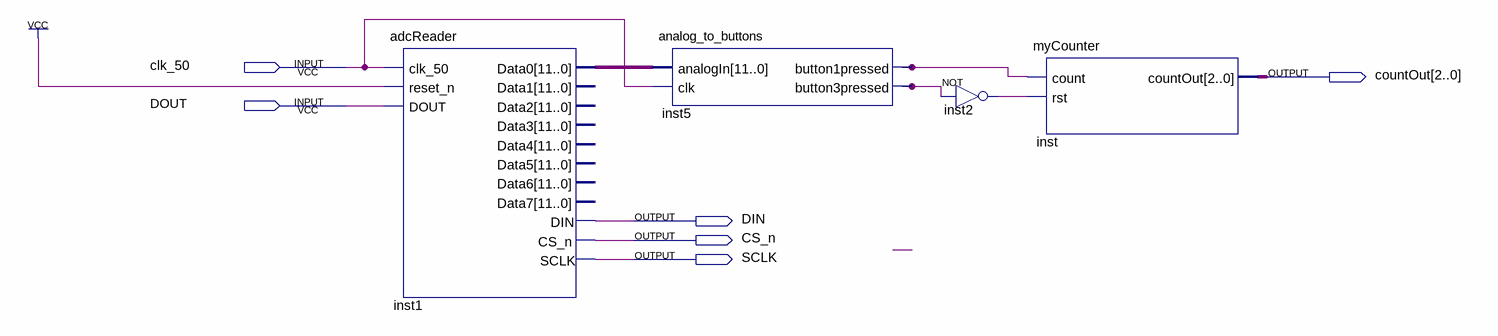
[diagram p0: schematic sheet]
// Quartus schematic CounterWithOutput.bdf as structural Verilog: 4 symbols, 6 pins
module CounterWithOutput (
  input  clk_50,
  input  DOUT,
  output [2:0] countOut,
  output DIN,
  output CS_n,
  output SCLK
);

  wire inst2_out, inst5_button1pressed, inst5_button3pressed;
  wire [11:0] inst1_data0;

  adcReader inst1 (
    .clk_50(clk_50), .reset_n(1'b1), .DOUT(DOUT), .Data0(inst1_data0), .DIN(DIN), .CS_n(CS_n), .SCLK(SCLK));  // open: Data1, Data2, Data3, Data4, Data5, Data6, Data7
  analog_to_buttons inst5 (
    .analogIn(inst1_data0), .clk(clk_50), .button1pressed(inst5_button1pressed),
    .button3pressed(inst5_button3pressed));
  not inst2 (inst2_out, inst5_button3pressed);
  myCounter inst (.count(inst5_button1pressed), .rst(inst2_out), .countOut(countOut));
endmodule
